# Altium schematic sheet Electronic_Theremin.SchDoc: Tactile Response for Electronic Theremin
size A4; Date: 17/06/2019; Engineer: RENATO BEDNARSKI RAMOS
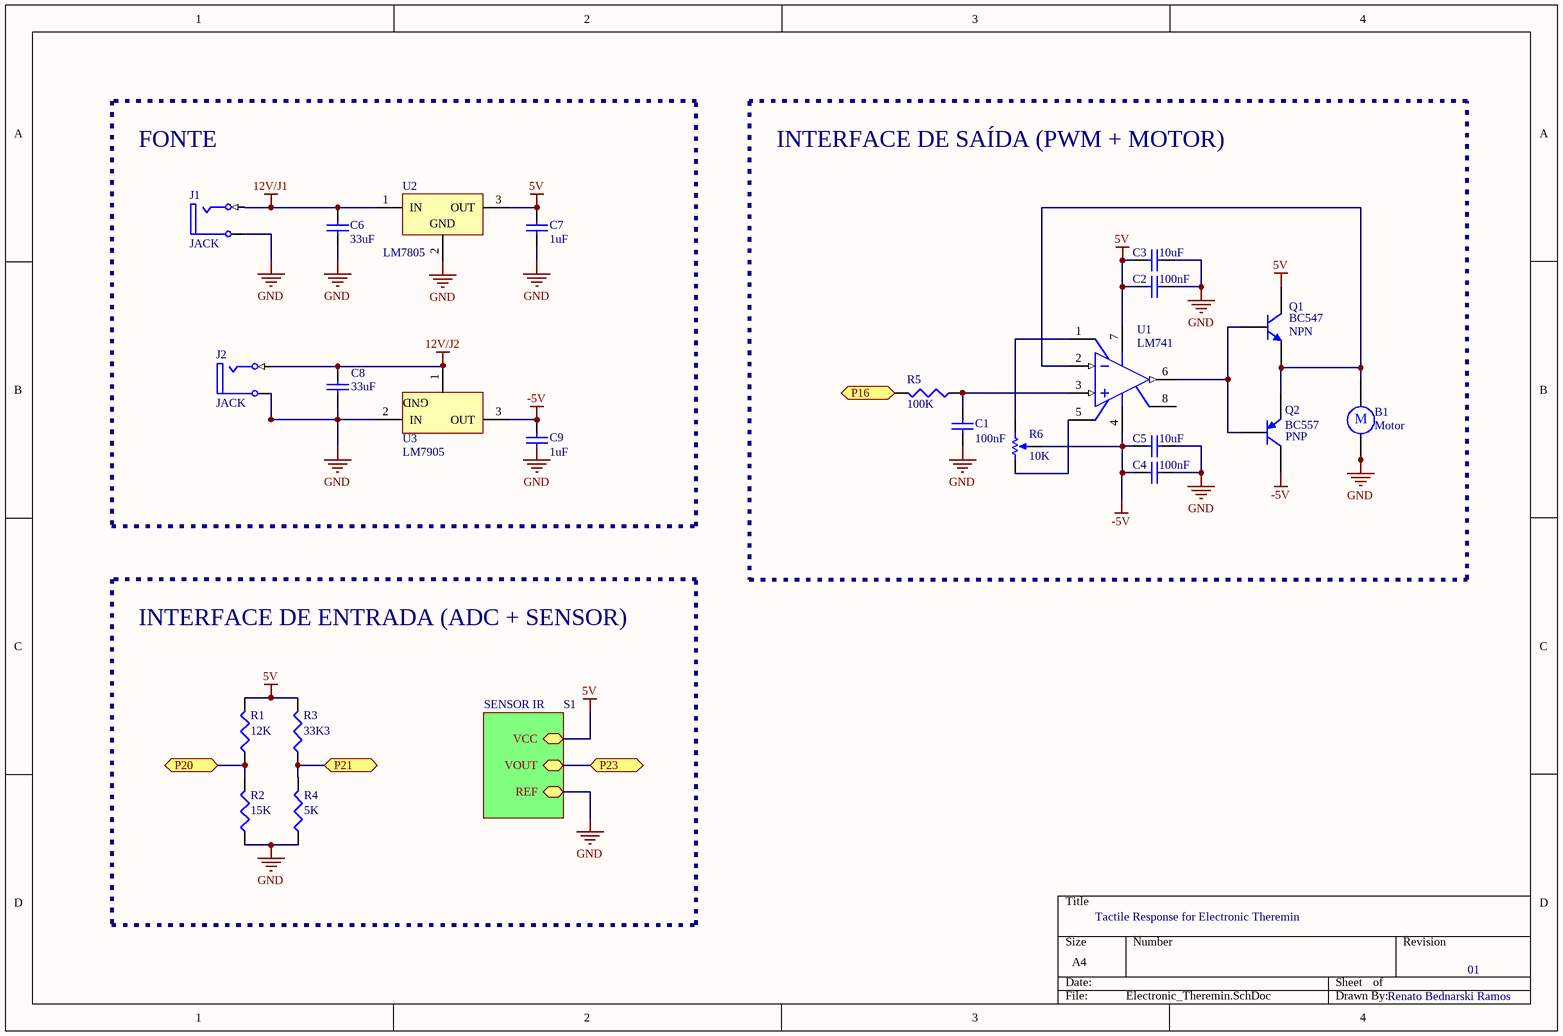
[diagram p0: Electronic_Theremin.SchDoc]

## Parts
B1  Motor  [RB5-10.5]
C1  value 100nF  [RAD-0.3]  (hidden comment: Cap)
C2  value 100nF  [RAD-0.3]  (hidden comment: Cap)
C3  value 10uF  [RAD-0.3]  (hidden comment: Cap)
C4  value 100nF  [RAD-0.3]  (hidden comment: Cap)
C5  value 10uF  [RAD-0.3]  (hidden comment: Cap)
C6  value 33uF  [RAD-0.3]  (hidden comment: Cap)
C7  value 1uF  [RAD-0.3]  (hidden comment: Cap)
C8  value 33uF  [RAD-0.3]  (hidden comment: Cap)
C9  value 1uF  [RAD-0.3]  (hidden comment: Cap)
J1  JACK  [JACK/6-V2]
J2  JACK  [JACK/6-V2]
Q1  NPN  value BC547  [TO-226-AA]
Q2  PNP  value BC557  [SOT-23B_N]
R1  value 12K  [J1-0603]  (hidden comment: Res3)
R2  value 15K  [J1-0603]  (hidden comment: Res3)
R3  value 33K3  [J1-0603]  (hidden comment: Res3)
R4  value 5K  [J1-0603]  (hidden comment: Res3)
R5  value 100K  [J1-0603]  (hidden comment: Res3)
R6  value 10K  [VR5]
U1  LM741  [N08E]
U2  LM7805  [KC03]
U3  LM7905  [T03B]

## Blocks framed on the sheet
FONTE: C6-C9 J1 J2 U2 U3
INTERFACE DE SAÍDA (PWM + MOTOR): B1 C1-C5 Q1 Q2 R5 R6 U1
INTERFACE DE ENTRADA (ADC + SENSOR): R1-R4

## Sub-sheets
S1 = SENSOR IR: VCC, VOUT, REF

## Ports
P16, P20, P21, P23

## Nets
5V: C2.2 C3.2 C7.2 Q1.1(C) R1.2 R3.2 U1.7(V+) U2.3(OUT) ; sheet S1/VCC
12V/J1: C6.2 J1.1(T) U2.1(IN)
12V/J2: C8.2 J2.1(T) U3.1(GND)
-5V: C4.2 C5.2 C9.2 Q2.1(C) R6.3(TAP) U1.4(V-) U3.3(OUT)
GND: C1.1 C2.1 C3.1 C4.1 C5.1 C6.1 C7.1 C8.1 J1.5(S) J2.5(S) R2.1 R4.1 U2.2(GND) U3.2(IN) ; sheet S1/REF
P16: R5.2 ; port P16
P20: R1.1 R2.2 ; port P20
P21: R3.1 R4.2 ; port P21
P23: port P23, sheet S1/VOUT
NetB1_1: B1.1 Q1.3(E) Q2.3(E) U1.2(IN-)
NetC1_2: C1.2 R5.1 U1.3(IN+)
NetQ1_2: Q1.2(B) Q2.2(B) U1.6(OUT)
NetR6_1: R6.1(TOP) U1.5(OFS_NULL)
NetR6_2: R6.2(BOT) U1.1(OFS_NULL)

Not connected (* = marked no-connect by the designer): B1 2; C9 1; U1 8(NC)

## Notes on the sheet
- Tactile Response for Electronic Theremin
- 01
- Renato Bednarski Ramos
- Labels drawn without touching a wire or pin: GND
- (in symbol Motor) M

## Library data of the parts
B1 = Motor: Motor, General Kind; Published: 24-Mar-1999; LatestRevisionDate: 17-Jul-2002; LatestRevisionNote: Re-released for DXP Platform.; PackageReference: RB5-10.5; Publisher: Altium Limited; PackageDescription: Capacitor (Radial); 2 Leads
C1-C9 = Cap: Capacitor; Published: 8-Jun-2000; LatestRevisionDate: 17-Jul-2002; LatestRevisionNote: Re-released for DXP Platform.; PackageReference: RAD-0.3; Publisher: Altium Limited; PackageDescription: Radial Cap, Thru-Hole; 2 Leads; 0.3 in Pin Spacing
J1 J2 = Phonejack2: Jack Socket, 1/4" [6.5mm], Thru-Hole, Vertical, 2-Conductor Open Circuit; PackageDocument: 2003; PCB_Layout: Complies with manufacturer's recommendation.; DrillAndSlotSize: Corresponds to nominal value.; LatestRevisionDate: 15-Jul-2004; LatestRevisionNote: Component Replaced.; DatasheetDocument: 2003; PackageReference: S1VS_SNS; Publisher: Altium Limited; ComponentLink1Description: Manufacturer Link; ComponentLink1URL: http://www.cliffuk.co.uk/
Q1 = NPN: NPN Bipolar Transistor; Published: 8-Jun-2000; LatestRevisionDate: 17-Jul-2002; LatestRevisionNote: Re-released for DXP Platform.; PackageReference: TO-226-AA; PackageDescription: TO, Flat Index; 3 In-Line, Axial Leads; Body Dia. 4.8mm; Leads 0.55 x 0.51 mm (max); Code_JEDEC: TO-226-AA
Q2 = PNP: PNP Bipolar Transistor; Published: 8-Jun-2000; LatestRevisionDate: 29-May-2009; LatestRevisionNote: IPC-7351 Footprint Added.; PackageVersion: Aug-1999; PackageReference: SOT-23B; PackageDescription: 3-Pin SOT-23 Package 0.95 mm Pitch, 2.4 mm Lead Span
R1-R5 = Res3: Resistor; Published: 8-Jun-2000; LatestRevisionDate: 29-May-2009; LatestRevisionNote: IPC-7351 Footprint Added.; PackageReference: J1-0603; Publisher: Altium Limited; PackageDescription: Chip Resistor
R6 = RPot: Potentiometer; Sim Note: Enter the Resistance value and the set point into parameter fields.; Set Position: 0.5; Published: 8-Jun-2000; LatestRevisionDate: 17-Jul-2002; LatestRevisionNote: Re-released for DXP Platform.; PackageReference: VR5; Publisher: Altium Limited; PackageDescription: Variable Resistor, Thru-Hole; 3 Leads
U1 = LM741CN: Operational Amplifier, 8-pin MDIP; Manufacturer: National Semiconductor; PackageTopMarking: NSUZXYTTE#*LM*741CN; PowerWise: N; CompType: Amplifiers; Published: 4-Dec-2008; LatestRevisionDate: 13-Jan-2009; LatestRevisionNote: Sim Model Added.; DatasheetVersion: Aug-2000; PackageVersion: revG, May-2006; PackageReference: N08E; Publisher: Altium Limited; PackageDescription: MDIP, .365 x .250 x .130in, 8 Lead, .100in Pitch; Supplier 1: Farnell; Supplier Part Number 1: 1523833; Supplier 2: Farnell; Supplier Part Number 2: 9486780; PartNumber: LM741CN; RoHS: N; PinCount: 8; Code_JEDEC: MS-001-BA; ComponentLink1Description: LM741 Datasheet; ComponentLink1URL: http://www.national.com/ds/LM/LM741.pdf; ComponentLink2Description: LM741 Web Page; ComponentLink2URL: http://www.national.com/pf/LM/LM741.html; ComponentLink3Description: N08E Package Page; ComponentLink3URL: http://www.national.com/packaging/folders/n08e.html
U2 = µA7805CKC: Positive-Voltage Regulator; Note: Pin 2 is electrically connected to TAB.; Published: 15-Apr-2002; DatasheetVersion: Jul-1999; PackageVersion: Sep-1995; PackageReference: KC03; Publisher: Altium Limited; PackageDescription: TO, Thru-Hole, Vertical, Heatsink Mounted; 3 In-Line Leads; Pitch 2.54 mm; ComponentLink1Description: Manufacturer Link; ComponentLink1URL: http://www.ti.com/; ComponentLink2Description: Datasheet; ComponentLink2URL: http://www-s.ti.com/sc/ds/ua7805.pdf
U3 = LM7905CT: 3-Terminal Negative Regulator, 3-pin TO-220; Manufacturer: National Semiconductor; PackageTopMarking: NSUZXYTTE#*LM7905CT; PowerWise: N; CompType: LDO IC; Published: 4-Dec-2008; DatasheetVersion: Sep-2001; PackageVersion: revL, Jan-1992; PackageReference: T03B; Publisher: Altium Limited; PackageDescription: TO-220, Molded, 3 Lead, Straight; Supplier 1: Farnell; Supplier Part Number 1: 9490370; PartNumber: LM7905CT; RoHS: N; PinCount: 3; ComponentLink1Description: LM7905 Datasheet; ComponentLink1URL: http://www.national.com/ds/LM/LM7905.pdf; ComponentLink2Description: LM7905 Web Page; ComponentLink2URL: http://www.national.com/pf/LM/LM7905.html; ComponentLink3Description: T03B Package Page; ComponentLink3URL: http://www.national.com/packaging/folders/t03b.html